# EAGLE design Adafruit USB Host BFF (EAGLE 9.6.2)
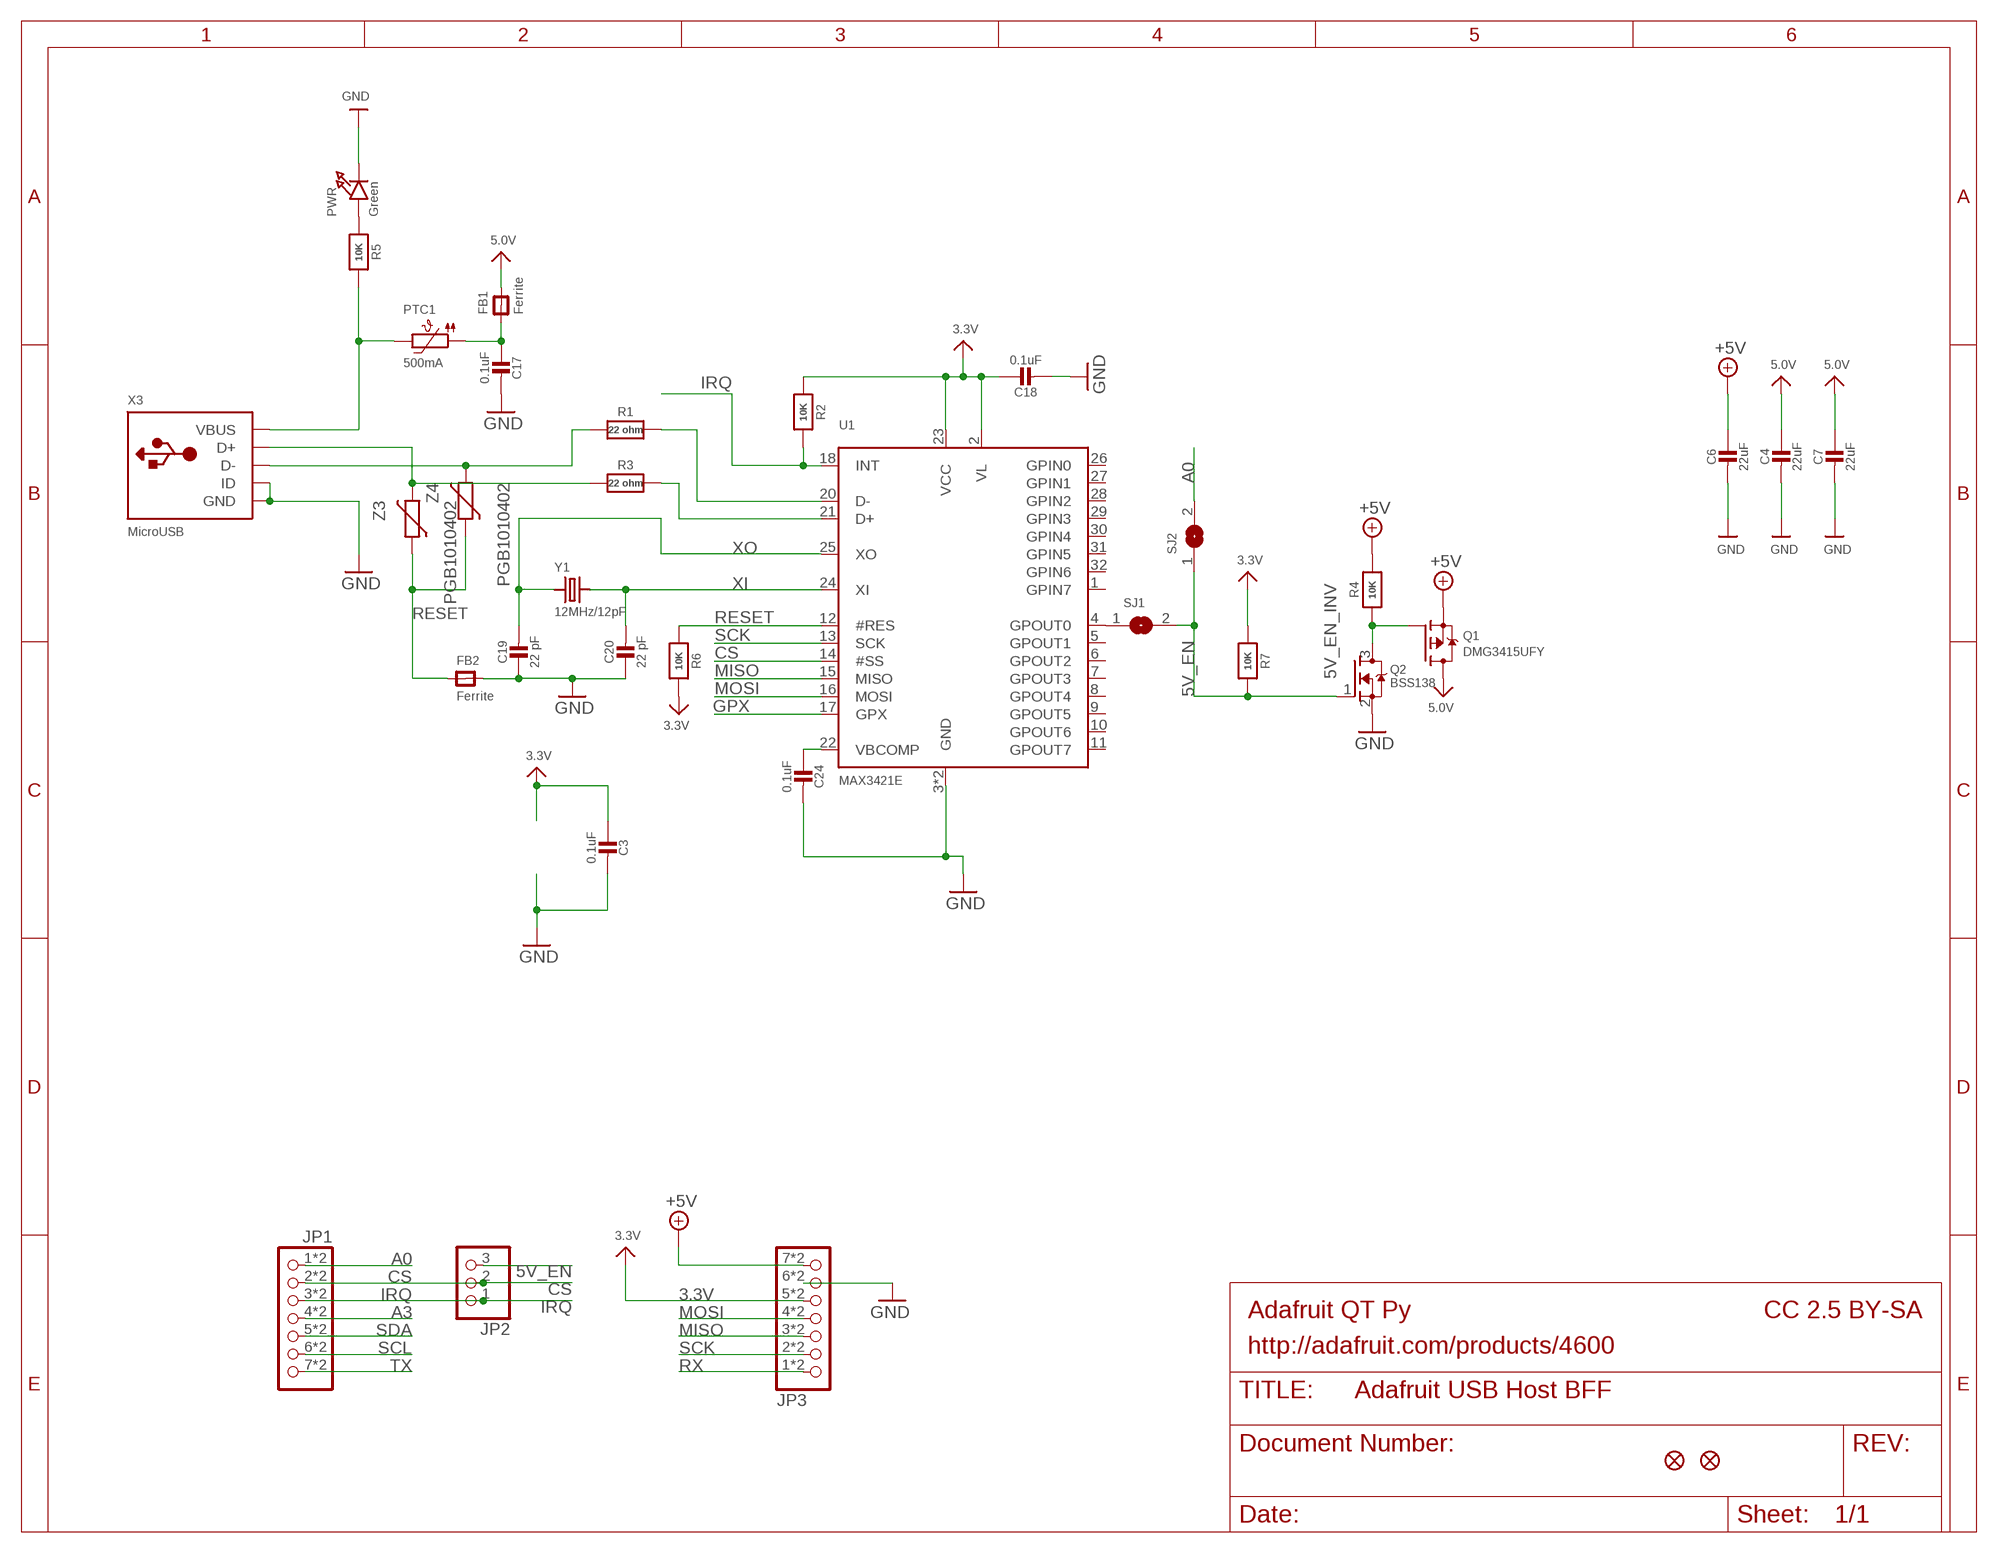
[diagram p0: schematic, sheet 1]

## Parts
C3  0.1uF  CAP_CERAMIC_0402NO  [_0402NO]
C4  22uF  CAP_CERAMIC0805-NOOUTLINE  [0805-NO]
C6  22uF  CAP_CERAMIC0805-NOOUTLINE  [0805-NO]
C7  22uF  CAP_CERAMIC0805-NOOUTLINE  [0805-NO]
C17  0.1uF  CAP_CERAMIC_0402NO  [_0402NO]
C18  0.1uF  CAP_CERAMIC_0402NO  [_0402NO]
C19  22 pF  CAP_CERAMIC_0402NO  [_0402NO]
C20  22 pF  CAP_CERAMIC_0402NO  [_0402NO]
C24  0.1uF  CAP_CERAMIC_0402NO  [_0402NO]
FB1  Ferrite  FERRITE-0603NO  [0603-NO]
FB2  Ferrite  FERRITE-0603NO  [0603-NO]
JP1  HEADER-1X7_CASTEL  [1X07_CASTEL]
JP2  HEADER-1X3ROUND  [1X03_ROUND]
JP3  HEADER-1X7_CASTEL  [1X07_CASTEL]
PTC1  500mA  PTC_0805  [0805-NO]
PWR  Green  LED0603_NOOUTLINE  [CHIPLED_0603_NOOUTLINE]
Q1  DMG3415UFY  MOSFET-P_DFN2015  [DFN2015-3]
Q2  BSS138  MOSFET-N_SC70  [SC70]
R1  22 ohm  RESISTOR_0402NO  [_0402NO]
R2  10K  RESISTOR_0402NO  [_0402NO]
R3  22 ohm  RESISTOR_0402NO  [_0402NO]
R4  10K  RESISTOR_0402NO  [_0402NO]
R5  10K  RESISTOR_0402NO  [_0402NO]
R6  10K  RESISTOR_0402NO  [_0402NO]
R7  10K  RESISTOR_0402NO  [_0402NO]
SJ1  SOLDERJUMPER  [SOLDERJUMPER_ARROW_NOPASTE]
SJ2  SOLDERJUMPER  [SOLDERJUMPER_ARROW_NOPASTE]
U1  MAX3421E  MAX3421E_QFP  [PQFP32_5X5MM]
U$6  FIDUCIAL_0.5MM  [FIDUCIAL_0.5MM]
U$8  FIDUCIAL_0.5MM  [FIDUCIAL_0.5MM]
X3  MicroUSB  USB_MICROXNJ073  [SHOU_MICROXNJ073]
Y1  12MHz/12pF  CRYSTAL2.5X2.0  [CRYSTAL_2.5X2]
Z3  PGB1010402  VARISTORCN0402  [CT/CN0402]
Z4  PGB1010402  VARISTORCN0402  [CT/CN0402]

## Nets
3.3V: C3.1 C18.1 JP3.5 JP3.5C R2.1 R6.2 R7.1 U1.2(VL) U1.23(VCC)
5.0V: C4.1 C7.1 FB1.2 Q1.3(D)
5V_EN: JP2.3 Q2.1(G) R7.2 SJ1.2 SJ2.1
5V_EN_INV: Q1.1(G) Q2.3(D) R4.1
+5V [power]: C6.1 JP3.7 JP3.7C Q1.2(S) R4.2
A0: JP1.1 JP1.1C SJ2.2
A3: JP1.4 JP1.4C
CS: JP1.2 JP1.2C JP2.2 U1.14(#SS)
GND [power]: C3.2 C4.2 C6.2 C7.2 C17.2 C18.2 C19.1 C20.1 C24.2 FB2.2 JP3.6 JP3.6C PWR.C Q2.2(S) U1.3(GND) U1.19(GND) X3.BASE@1(GND) X3.BASE@2(GND) X3.GND X3.ID X3.SPRT@1(GND) X3.SPRT@2(GND) X3.SPRT@3(GND) X3.SPRT@4(GND)
GPX: U1.17(GPX)
IRQ: JP1.3 JP1.3C JP2.1 R2.2 U1.18(INT)
MISO: JP3.3 JP3.3C U1.15(MISO)
MOSI: JP3.4 JP3.4C U1.16(MOSI)
N$1: C24.1 U1.22(VBCOMP)
N$2: SJ1.1 U1.4(GPOUT0)
N$3: FB2.1 Z3.1 Z4.1
N$4: PWR.A R5.1
N$26: R1.1 X3.D- Z4.2
N$27: R3.1 X3.D+ Z3.2
N$28: R1.2 U1.20(D-)
N$29: R3.2 U1.21(D+)
N$32 [power usb]: PTC1.2 R5.2 X3.VBUS
N$33 [power usb]: C17.1 FB1.1 PTC1.1
RESET: R6.1 U1.12(#RES)
RX: JP3.1 JP3.1C
SCK: JP3.2 JP3.2C U1.13(SCK)
SCL: JP1.6 JP1.6C
SDA: JP1.5 JP1.5C
TX: JP1.7 JP1.7C
XI: C20.2 U1.24(XI) Y1.3
XO: C19.2 U1.25(XO) Y1.1
Unconnected: U1.1(GPIN7) U1.5(GPOUT1) U1.6(GPOUT2) U1.7(GPOUT3) U1.8(GPOUT4) U1.9(GPOUT5) U1.10(GPOUT6) U1.11(GPOUT7) U1.26(GPIN0) U1.27(GPIN1) U1.28(GPIN2) U1.29(GPIN3) U1.30(GPIN4) U1.31(GPIN5) U1.32(GPIN6)

## Notes on the sheet
- Adafruit QT Py | CC 2.5 BY-SA
- http://adafruit.com/products/4600

## Library data of the parts
C3 C4 C6 C7 C17-C20 C24 = microbuilder:CAP_CERAMIC: Ceramic Capacitors For new designs, use the packages preceded by an '_' character since they are more reliable: The following footprints should be used on most boards: _0402 - Standard footprint for regular board layouts _0603 - Standard footprint for regular board layouts _0805 - Standard footprint for regular board layouts _1206 - Standard footprint for regular board layouts For extremely tight-pitch boards where space is at a premium, the following 'micro-pitch' footprints can be used (smaller pads, no silkscreen outline, etc.): _0402MP - Micro-pitch footprint for very dense/compact boards _0603MP - Micro-pitch footprint for very dense/compact boards _0805MP - Micro-pitch footprint for very dense/compact boards _1206MP - Micro-pitch footprint for very dense/compact boards
FB1 FB2 = microbuilder:FERRITE: Ferrite Bead 0603 MMZ1608B121C - 120 Ohm @ 100MHz, 600mA, 0.15 Ohm DC Resistance - Digikey: 445-2164-1-ND BK1608HW121-T - 120 Ohm, 600mA Ferrite Chip - Digikey: 587-1876-2-ND 0805 HZ0805B272R-10 - 2.7K Ohm @ 100MHz, 200mA, 0.8 Ohm DC Resistance - Digikey: 240-2504-1-ND (see also Murata BLM21BD272SN1L) MMZ2012Y152B - 1.5K Ohm @ 100MHz, 500mA, 0.4 Ohm DC Resistance - Digikey: 445-1560-1-ND - Mainly for high frequency (80-400MHz) MMZ2012R102A - 1K Ohm @ 100MHz, 500mA, 0.3 Ohm DC Resistance - Digikey: 445-1555-2-ND - More general purpose (10-200MHz)
JP1 JP3 = adafruit_electromech:HEADER-1X7: PIN HEADER
JP2 = microbuilder:HEADER-1X3: PIN HEADER
PTC1 = microbuilder:PTC: PTC (Resettable Fuse) 1206 Package 250mA PTC (16V Max, Time-to-Trip: 0.08s) - Digikey: F2110CT-ND 1210 Package 100mA PTC (30V Max, Time-to-Trip: 0.6s) - Digikey: MF-USMF010-2CT-ND 1812 Package 750mA PTC (24V Max, Time-to-Trip: 0.2s) - Digikey: MF-MSMF075/24-2CT-ND
PWR = microbuilder:LED: LED 0603 - 0603 Surface Mount Package 2mA: Green LED - Low Power (3.9mcd, 2ma, 1.7Vf) - Digikey: 475-2709-2-ND Orange LED - Low Power (9.8mcd, 2ma, 1.8Vf) - Digikey: 475-1194-2-ND Red LED - Low Power (5mcd, 2ma, 1.8Vf) - Digikey: 475-1195-2-ND Yellow LED - Low Power (7mcd, 2ma, 1.8Vf) - Digikey: 475-1196-2-ND 5mA: Blue LED - Low Power (17mcd, 5ma, 2.9Vf) - Digikey: LNJ937W8CRACT-ND 0805 - 0805 Surface Mount Package 2mA: Red LED (8.8mcd, 2mA, 1.8Vf, Clear) - Low Power [Digikey: 475-2510-1-ND] Green LED (5mcd, 2mA, 1.8Vf, Clear) - Low Power [Digikey: 475-2730-1-ND] Yellow LED (11.3mcd, 2mA, 1.8Vf, Clear) - Low Power [Digikey: 475-2555-1-ND] 20mA: Red LED (104mcd, 20mA, Diffused) - LS R976 [Digikey: 475-1278-6-ND] Red LED (12mcd, 20mA, 2.0Vf, Clear) - APT2012EC [Digikey: 754-1128-1-ND] Green LED (15mcd, 20mA, 2.2Vf, Clear) - APT2012GC [Digikey: 754-1131-1-ND] Orange LED (160mcd, 20mA, 2.1Vf, Clear) - APT2012SECK [Digikey: 754-1130-1-ND] 1206 - 1206 Surface Mount Package Green LED (26mcd, 20mA, Diffused) - LG N971 [Digikey: 475-1407-6-ND] Red LED (15mcd, 20mA, Diffused) - LH N974 [Digikey: 475-1416-6-ND] Cree - Cree High-Power Surface Mount LEDs XPEBWT-L1-0000-00D50 - White 111lm 350mA 2.9Vf 6200K 110° XTEAWT-00-0000-00000LEE3 - White 114lm 350mA 2.85Vf 5000K 115° Everlight - Everlight 45-21 Series Surface Mount LEDs 45-21/QK2C-B2832AC2CB2/2T - Warm White 2000mcd 20mA 3.25Vf 3050K 120° 45-21/LK2C-B38452C4CB2/2T - Nuetral White 2000mcd 20mA 3.25Vf 4150K 120° 45-21/LK2C-B50634C6CB2/2T - Cold White 2200mcd 20mA 3.25Vf 5650K 120° PLCC2 Reverse Mount LS T77K-J1L2-1-0-2-R18-Z - Red 11.25mcd 2mA 1.8Vf 630nm 120° LO T77K-L1M2-24-Z - Orange 19.6mcd 2mA 1.8Vf 606nm 120° LY T77K-K2M1-26-Z - Yellow 15.7mcd 2mA 1.8Vf 587nm 120°; ROT: 270
Q1 = microbuilder:MOSFET-P: P-Channel Mosfet LEGEND VDS: Voltage Drain-Source ID: Drain Current RDS(ON): Drain-Source On-State Resistance VGS(TH): Gate-Source Threshold Voltage CISS: Drain-Source Input Capacitance SOT-23 Name VDS ID RDS(ON) VGS(TH) CISS Order Number IRLML5103 30V 760mA 600 mOhm -- 75pF @ 25V Digikey: IRLML5103PBFCT-ND IRLML6401 12V 4.3A 50 mOhm 950mV @ 250µA 830pF @ 10V Digikey: IRLML6401PBFTR-ND NTR0202PL 20V 400mA 800 mOhm 2.3V @ 250uA 70pF @ 5V Digikey: NTR0202PLT1GOSTR-ND NTR4101PT1G 20V 1.8A 85 mOhm 1.2V @ 250uA 675pF @ 10V Digikey: NTR4101PT1GOSCT-ND DMP2004K 20V 600mA 900 mOhm 1V @ 250uA 175pF @ 16V Digikey: DMP2004KDICT-ND PMV65XP 20V 3.9A 76 mOhm 950mV @ 1mA 725pF @ 20V Digikey: 568-2358-2-ND TO-252 Name VDS ID RDS(ON) VGS(TH) CISS Order Number AOD417 30V 25A 34 mOhm 3V @ 250µA 920pF @ 15V Digikey: 785-1106-2-ND PowerPak Name VDS ID RDS(ON) VGS(TH) CISS Order Number AON7401 30V 12A 14 mOhm 3V @ 250µA 2600pF @ 15V Digikey: 785-1302-1-ND
Q2 = microbuilder:MOSFET-N: N-Channel Mosfet LEGEND VDS: Voltage Drain-Source ID: Drain Current RDS(ON): Drain-Source On-State Resistance VGS(TH): Gate-Source Threshold Voltage CISS: Drain-Source Input Capacitance SOT-23 Name VDS ID RDS(ON) VGS(TH) CISS Order Number 2N7002E 60V 260mA 2.5 Ohm 2.5V @ 250uA 26.7pF @ 25V 2N7002ET1GOSTR-ND BSH103 30V 850mA 400 mOhm 400mV @ 1mA 83pF @ 24V BSH103,235-ND BSS138 60V 320mA 1.6 Ohm 1.5V @ 250uA 50pF @ 10V Mouser: 771-BSS138PW115 DMN2075U-7 20V 4.2A 38 mOhm 1V @ 250 uA 594.3pF @ 10V DMN2075U-7DICT-ND * BSS138 good choice for I2C level-shifting POWERPAK 1212-8 Name VDS ID RDS(ON) VGS(TH) CISS Order Number Si7308DN 60V 6A 58 mOhm 3V @ 250uA 665pF @ 15V SI7308DN-T1-E3CT-ND
R1-R7 = microbuilder:RESISTOR: Resistors For new designs, use the packages preceded by an '_' character since they are more reliable: The following footprints should be used on most boards: _0402 - Standard footprint for regular board layouts _0603 - Standard footprint for regular board layouts _0805 - Standard footprint for regular board layouts _1206 - Standard footprint for regular board layouts For extremely tight-pitch boards where space is at a premium, the following 'micro-pitch' footprints can be used (smaller pads, no silkscreen outline, etc.): _0402MP - Micro-pitch footprint for very dense/compact boards _0603MP - Micro-pitch footprint for very dense/compact boards _0805MP - Micro-pitch footprint for very dense/compact boards _1206MP - Micro-pitch footprint for very dense/compact boards
SJ1 SJ2 = microbuilder:SOLDERJUMPER: SMD Solder JUMPER Solder the two pads together to create a connection, or remove the solder to break it. REFLOW - Use this footprint for solder paste and reflow ovens. WAVE - Use this footprint for hand-soldering (larger pads). CLOSED - Has a trace between the two pads to ensure it is closed by default. The trace needs to be cut to disable the jumper, and can be closed again by creating a solder bridge between the two pads.; BOM: EXCLUDE
U1 = microbuilder:MAX3421E: MAX3421E SPI-Interface USB Device/Host Controller Digikey: MAX3421EETJ+-ND
U$6 U$8 = microbuilder:FIDUCIAL: Fiducial Alignment Points Various fiducial points for machine vision alignment.
X3 = adafruit_electromech:USB: USB Connectors USBMINIB - Surface Mount Female Mini-B USB Connector 4UConnector: 06564; LCSC: C404969
Y1 = microbuilder:CRYSTAL: Crystals HC49UP - Surface Mount Crystal 4.0MHz 18pF +/-30ppm Surface Mount Crystal [Digikey: 535-9857-1-ND] 12.0 MHz Surface Mount Crystal [Digikey: 535-9869-6-ND] 25.0 MHz Surface Mount Crystal [Digikey: 535-9078-1-ND] 2.5 x 2.0mm - MEMs SMT Crystal 16.0 MHz 10pF 20ppm 2.5 x 2.0mm Crystal [Digikey -40-85°C: 535-10923-1-ND] 3.2 x 2.5mm - MEMs SMT Crystal 12.0 MHz 8pF 15ppm 3.2 x 2.5mm Crystal [Digikey: -10-70°C: 644-1047-1-ND -40-125°C: 644-1128-1-ND] 40~85°C cheaper: 644-1173-6-ND 16.0 MHz 8pF 15ppm 3.2 x 2.5mm Crystal [Digikey: -10-70°C: 644-1049-1-ND -40-125°C: 644-1129-2-ND]-40~85°C cheaper: 644-1175-6-ND 16.0 MHz 10pF 10ppm 3.2 x 2.5mm Crystal [Digikey: 644-1100-1-ND] 27.12 MHz 18pF 30ppm 3.2 x 2.5mm Crystal [Digikey: 887-1424-1-ND] 27.12MHz 10pF 10ppm 3.2 x 2.5mm Crystal [Digikey: 887-1329-1-ND] 4.9 x 1.8mm - MEMs SMT Crystal 32.768 KHz 12.5pF 20ppm 4.9 x 1.8mm Crystal [Digikey: SE2415CT-ND] 8.0 x 3.8mm - Surface Mount Crystal 32.768kHz 12.5pF 20ppm -40°C-85°C [Digikey: 535-9166-2-ND] Cylinder 32.768KHz Cylinder Crystal (2x6mm body) [Ex. Digikey: 300-8341-2-ND]
Z3 Z4 = varistor:VARISTOR: VARISTOR

## Net classes
1 power: width 0.305 mm
2 thickpower: width 0.406 mm
3 power usb: width 0.254 mm, drill 0.381 mm, clearance 0.203 mm

## Board
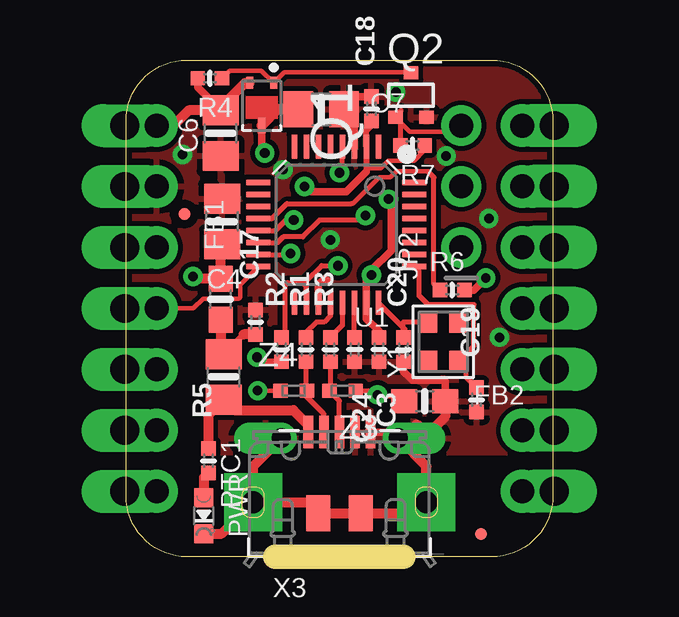
[diagram p1: board, top side]
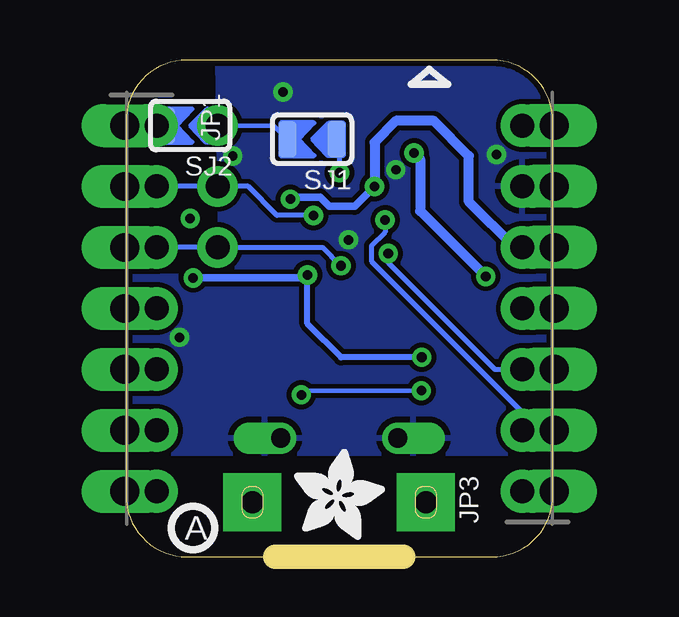
[diagram p2: board, bottom side, seen from below]

Size 17.78 x 20.7 mm. Coordinates in mm from the lower left corner, seen from the top.
Outline: 17.78,18.16 17.78,2.54 arc-90 15.24,0 2.54,0 arc-90 0,2.54 0,18.16 arc-90 2.54,20.7 15.24,20.7 arc-90 17.78,18.16
Copper layers (1*16): Top 0.035mm / dielectric 1.5mm / Bottom 0.035mm
Design rules "adafruit 7-7": minimum track width 7mil, minimum drill 15.5mil, track to track 8mil, track to pad 7mil, pad to pad 7mil, via to via 7mil, smd to smd 7mil, copper to edge 10mil, drill to drill 8mil, minimum pad ring 10mil, minimum via ring 8mil, stop-mask expansion 2mil, vias tented up to drill 20mil, thermal gap 10mil

### Footprints (pad centres in the part's own frame; a part is rotated, then mirrored left to right if it is on the bottom)
_0402NO = smd 0.6 x 0.6: 1 -0.508,0; 2 0.508,0
0805-NO = smd 1.24 x 1.5: 1 -0.95,0; 2 0.95,0
0603-NO = smd 1.075 x 1: 1 -0.85,0; 2 0.85,0
1X07_CASTEL = drill 1 pad 1.778: 1 -7.62,0; 2 -5.08,0; 3 -2.54,0; 4 0,0; 5 2.54,0; 6 5.08,0; 7 7.62,0 | drill 1.2 pad 1.778 long: 1C -7.62,-1.324; 2C -5.08,-1.324; 3C -2.54,-1.324; 4C 0,-1.324; 5C 2.54,-1.324; 6C 5.08,-1.324; 7C 7.62,-1.324
1X03_ROUND = drill 1 pad 1.676: 1 -2.54,0; 2 0,0; 3 2.54,0
CHIPLED_0603_NOOUTLINE = smd 0.8 x 0.8: A 0,-0.75; C 0,0.75
DFN2015-3 = smd 0.5 x 0.31: 1 -0.95,0.5; 2 -0.95,-0.5 | smd 0.65 x 0.31: 3 0.825,0
SC70 = smd 0.6 x 0.55: 1 -0.65,-0.925; 2 0.65,-0.925; 3 0,0.925
SOLDERJUMPER_ARROW_NOPASTE = smd 0.762 x 1.524: 1 -1.016,0; 2 1.016,0
PQFP32_5X5MM = smd 0.23 x 1: 1 -1.75,-3.25; 2 -1.25,-3.25; 3 -0.75,-3.25; 4 -0.25,-3.25; 5 0.25,-3.25; 6 0.75,-3.25; 7 1.25,-3.25; 8 1.75,-3.25; 17 1.75,3.25; 18 1.25,3.25; 19 0.75,3.25; 20 0.25,3.25; 21 -0.25,3.25; 22 -0.75,3.25; 23 -1.25,3.25; 24 -1.75,3.25 | smd 1 x 0.23: 9 3.25,-1.75; 10 3.25,-1.25; 11 3.25,-0.75; 12 3.25,-0.25; 13 3.25,0.25; 14 3.25,0.75; 15 3.25,1.25; 16 3.25,1.75; 25 -3.25,1.75; 26 -3.25,1.25; 27 -3.25,0.75; 28 -3.25,0.25; 29 -3.25,-0.25; 30 -3.25,-0.75; 31 -3.25,-1.25; 32 -3.25,-1.75
FIDUCIAL_0.5MM = smd 0.5 x 0.5: 1 0,0
SHOU_MICROXNJ073 = smd 1 x 1.5: BASE@1 -0.889,-2.121; BASE@2 0.889,-2.121 | smd 0.4 x 1.35: D+ 0,1.26; D- -0.65,1.26; GND 1.3,1.26; ID 0.65,1.26; VBUS -1.3,1.26 | drill 0.8 pad 1.143 offset: SPRT@1 -2.425,1.01; SPRT@2 2.45,1.01 | drill 0.9 pad 2.413 square: SPRT@3 -3.6,-1.665; SPRT@4 3.625,-1.665
CRYSTAL_2.5X2 = smd 0.9 x 0.75: 1 -0.825,-0.625; 2 0.825,-0.625; 3 0.825,0.625; 4 -0.825,0.625
CT/CN0402 = smd 0.6 x 0.6: 1 -0.55,0; 2 0.55,0

### Placement (x,y rotation side)
C3  10.54,8.64 270 top
C4  4,13.97 90 top
C6  3.94,17.65 270 top
C7  8.13,18.64 0 top
C17  5.4,9.78 90 top
C18  10.22,18.67 90 top
C19  14.61,6.54 90 top
C20  11.56,8.64 90 top
C24  9.53,8.64 270 top
FB1  3.94,10.73 90 top
FB2  12.45,6.48 0 top
JP1  16.51,10.35 270 bottom
JP2  13.97,15.43 90 top
JP3  1.27,10.35 90 bottom
PLABEL0  [PLABEL0]  2.73,10.29 90 top
PLABEL1  [PLABEL1]  2.73,12.83 90 top
PLABEL2  [PLABEL2]  2.73,15.49 0 top
PLABEL3  [PLABEL3]  1.71,19.56 0 top
PLABEL4  [PLABEL4]  15.24,19.37 0 top
PLABEL5  [PLABEL5]  15.24,15.56 0 top
PLABEL6  [PLABEL6]  15.18,12.95 0 top
PLABEL7  [PLABEL7]  15.18,10.35 0 top
PLABEL8  [PLABEL8]  14.61,4.95 0 top
PLABEL9  [PLABEL9]  14.8,2.67 0 top
PLABEL10  [PLABEL10]  3.37,5.4 0 top
PLABEL11  [PLABEL11]  2.73,7.68 90 top
PLABEL12  [PLABEL12]  1.65,1.21 0 top
PLABEL13  [PLABEL13]  12.45,18.22 90 bottom
PLABEL14  [PLABEL14]  11.75,15.37 0 bottom
PLABEL15  [PLABEL15]  12.06,13.14 0 bottom
PLABEL16  [PLABEL16]  5.33,17.27 0 bottom
PLABEL17  [PLABEL17]  8.76,8.76 0 bottom
PTC1  4.06,7.49 270 top
PWR  3.24,1.71 180 top
Q1  5.65,18.8 270 top
Q2  11.87,19.24 0 top
R1  7.49,8.64 90 top
R2  6.48,8.64 90 top
R3  8.51,8.64 90 top
R4  3.49,19.94 180 top
R5  3.43,4 90 top
R6  13.59,11.11 0 top
R7  11.94,17.14 180 top
SJ1  10.03,17.4 180 bottom
SJ2  15.11,17.97 180 bottom
U1  8.76,13.84 180 top
U$2  [ADAFRUIT_3.5MM]  10.79,0.7 0 bottom
U$6  2.43,14.29 0 top
U$8  14.8,0.95 0 top
U$13  [PCBFEAT-REV-040]  14.99,1.21 0 bottom
X3  8.89,3.94 0 top
Y1  13.21,8.95 90 top
Z3  9.02,6.92 180 top
Z4  6.99,6.92 0 top

### Tracks (layer width: path | path; a pad name or v marks a point on that pad's centre or on a via)
3.3V  (via drill 0.39, 0.4)
  Top 0.178: 10.89,16.48 | 10.01,16.19 10.61,16.19 10.89,16.48 | R7.1 12.45,16.95 12,16.51 10.92,16.51 10.89,16.48
  Top 0.203: 10.54,9.4 C3.1 | v10.22,11.75 10.22,11.94
  Top 0.254: v5.46,8.31 5.65,8.13 R2.1 | 10.01,11.54 v10.22,11.75 | C18.1 10.22,17.97 10.01,17.76 U1.2 10.01,16.19 10.01,16.05
  Top 0.305: 10.54,9.4 10.01,9.93 U1.23 10.01,11.54 | 10.22,11.94 11.05,12.76 11.05,14.79 v10.94,14.9 | 7.49,15.43 7.72,15.21 9.17,15.21 10.01,16.05 | v14.99,11.62 14.48,11.11 R6.2
  Top 0.406: JP3.5C JP3.5 | 7.49,15.43 v7.43,15.43
  Bottom 0.254: v5.46,8.31 8.82,8.31 10.22,9.72 10.22,11.62 v10.22,11.75
  Bottom 0.305: v10.94,14.9 10.85,14.99 9.69,14.99 9.31,14.61 8.26,14.61 v7.43,15.43 | v14.99,11.62 10.22,11.62
  Bottom 0.406: JP3.5C 1.59,12.89 3.49,14.8 3.49,16.7 4.95,18.16 6.54,18.16 7.43,17.27 v7.43,15.43
5.0V  (via drill 0.4)
  Top 0.305: Q1.3 5.65,17.14 5.78,17.02
  Top 0.406: C4.1 3.94,12.96 FB1.2 2.9,11.58 v2.79,11.68 | C7.1 6.32,18.64 Q1.3 | v5.78,16.83 5.78,17.02
  Bottom 0.406: v5.78,16.83 5.52,16.57 5.52,14.41 v2.79,11.68 | v2.79,11.68
5V_EN
  Top 0.178: Q2.1 11.83,17.71 13.78,17.71 JP2.3
  Top 0.203: Q2.1 11.45,18.61 11.33,18.33 11.43,18.22 R7.2
  Bottom 0.178: JP2.3 SJ2.1 11.62,17.97 SJ1.2
5V_EN_INV
  Top 0.178: R4.1 4.32,20.26 5.63,20.26 Q1.1 6.6,20.19 11.85,20.19 Q2.3
+5V
  Top 0.305: C6.1 2.98,19.55 R4.2
  Top 0.406: JP3.7C JP3.7 1.97,17.97 2.6,18.6 C6.1 3.94,18.73 4.03,18.86 4.07,18.86 4.96,19.75 Q1.2
A0
  Top 0.406: JP1.1C JP1.1
  Bottom 0.178: SJ2.2 JP1.1
A3
  Top 0.406: JP1.4C JP1.4
CS  (via drill 0.4)
  Top 0.203: U1.14 6.3,13.09 6.54,13.34 7.37,13.34 8.06,14.03 9.78,14.03 v9.97,14.22
  Top 0.406: JP1.2C JP1.2
  Bottom 0.203: JP1.2 JP2.2 12.7,15.43 11.49,14.22 v9.97,14.22
GND  (via drill 0.39)
  Top 0.305: U1.19 8.01,11.35 8.18,11.51 8.41,11.51 | C20.1 11.56,7.74 11.94,7.35 13.23,7.35 13.3,7.29 FB2.2 | X3.GND 11.09,5.2 11.44,4.85 | U1.3 9.51,18.4 9.27,18.64 C7.2 9.61,19.18 C18.2
  Top 0.406: X3.SPRT@3 5.29,3.77 X3.SPRT@1 | X3.SPRT@3 7.54,2.27 X3.BASE@1 X3.BASE@2 12.06,1.82 X3.SPRT@4 12.52,3.77 11.44,4.85 | 11.44,4.85 12.11,5.51 12.54,5.08 13.3,5.84 FB2.2 | 11.44,4.85 X3.SPRT@2 | PWR.C 3.98,0.96 X3.SPRT@3
  other vias: 6.54,16.13 13.34,16.7 15.56,9.14 15.11,14.1 8.51,13.21 2.35,16.76 11.24,19.37
  pour Top: 0,20.7 17.65,20.7 17.65,4.32 0,4.32
  pour Bottom: 0,20.7 13.97,20.7 13.84,11.68 17.78,11.68 17.78,4.32 0,4.32
IRQ  (via drill 0.4)
  Top 0.203: U1.18 7.51,11.28 | 7.51,11.28 7.51,11.49 8.15,12.13 v8.83,12.13 | R2.2 6.6,9.27 6.6,11.3 6.73,11.43 7.37,11.43 7.51,11.28
  Top 0.406: JP1.3C 17.08,12.89 17.02,12.83 16.57,12.83 JP1.3
  Bottom 0.203: JP1.3 14.03,12.89 JP2.1 13.91,12.89 9.59,12.89 v8.83,12.13
MISO  (via drill 0.4)
  Top 0.203: U1.15 6.81,12.59 v6.86,12.64
  Top 0.406: JP3.3C JP3.3
  Bottom 0.203: v6.86,12.64 6.86,12.26 2.41,7.81 JP3.3
MOSI
  Top 0.178: U1.16 4.75,11.33 4.75,10.82 4.69,10.76 3.21,10.76 2.79,10.35 JP3.4
  Top 0.406: JP3.4C JP3.4
N$1
  Top 0.203: C24.1 9.51,9.16 U1.22
N$2  (via drill 0.4)
  Top 0.203: v8.89,16 8.89,16.07 9.01,16.19 U1.4
  Bottom 0.203: SJ1.1 8.89,17.27 v8.89,16
N$3  (via drill 0.39)
  Top 0.178: FB2.1 11.39,6.69 10.54,6.69 v10.48,6.75 | Z4.1 v5.48,6.92
  Top 0.203: Z3.1 10.29,6.92 v10.48,6.75
  Bottom 0.178: v10.48,6.75 10.31,6.92 v5.48,6.92
N$4
  Top 0.406: R5.1 3.24,3.3 PWR.A
N$26
  Top 0.203: R1.1 7.49,7.04 Z4.2 7.54,6.66 8.24,5.96 X3.D-
N$27
  Top 0.203: X3.D+ 8.89,6.5 Z3.2 8.48,6.95 8.51,6.92 R3.1
N$28
  Top 0.203: U1.20 8.51,10.04 8.26,9.78 7.94,9.78 7.49,9.34 R1.2
N$29
  Top 0.203: U1.21 9.01,9.65 R3.2
N$32
  Top 0.254: X3.VBUS 7.59,5.49
  Top 0.406: 7.59,5.49 6.97,6.11 4.5,6.11 PTC1.2 3.43,5.91 R5.2
N$33
  Top 0.254: 4.89,9.27 PTC1.1
  Top 0.406: C17.1 4.89,9.27 | FB1.1 3.94,8.57 PTC1.1
RESET
  Top 0.178: 9.38,14.72 9.45,14.72 10.54,15.81 11.02,15.81 11.27,16.07 12.57,16.07
  Top 0.203: U1.12 6.08,14.09 6.7,14.72 9.38,14.72 | R6.1 12.83,11.37 12.83,15.81 12.57,16.07
RX
  Top 0.406: JP3.1C JP3.1
SCK  (via drill 0.4)
  Top 0.203: v6.99,14.03 6.65,14.03 6.21,13.59 U1.13
  Top 0.406: JP3.2C JP3.2
  Bottom 0.203: v6.99,14.03 6.99,13.53 7.56,12.95 7.56,12.32 1.27,6.03 JP3.2
SCL
  Top 0.406: JP1.6C JP1.6
SDA
  Top 0.406: JP1.5C JP1.5
TX
  Top 0.406: JP1.7C JP1.7
XI
  Top 0.203: Y1.3 11.56,9.78 C20.2 11.62,9.21 11.62,9.49 U1.24
XO
  Top 0.203: C19.2 14.16,7.49 14.16,8.13 Y1.1 14.49,8.78 14.49,10.51 12.59,10.51 12.2,10.89 12.2,11.9 U1.25

### Text on the board
Pinguin_tBackup: 5V | 5V | A0 | A0 | NP | Sw | G | 1 | 3V | 2 | MO | 3 | MI | SCK | SCL | TX | ON | RX | BFF | TX
Pinguin_bBackup: USB | 5VEN | QTPy / USB | IRQ | CS | IoT Button / NeoPixel on A3 / Button on A2 / QT Py. Solder / back to / back | MAX3421E / USB Host / QTPy BFF | μB / OTG